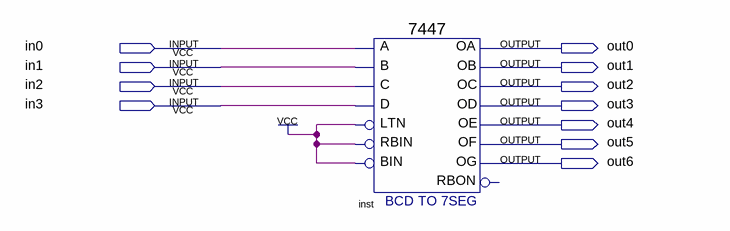
[diagram p0: schematic sheet]
// Quartus schematic conv_bit_7seg.bdf as structural Verilog: 1 symbols, 11 pins
module conv_bit_7seg (
  input  in0,
  input  in1,
  input  in2,
  input  in3,
  output out0,
  output out1,
  output out2,
  output out3,
  output out4,
  output out5,
  output out6
);

  \7447  inst (
    .LTN(1'b1), .B(in1), .C(in2), .D(in3), .RBIN(1'b1), .BIN(1'b1), .A(in0), .OB(out1), .OC(out2), .OE(out4),
    .OD(out3), .OF(out5), .OG(out6), .OA(out0));  // open: RBON
endmodule
